# EAGLE schematic esp8266_ver3 (EAGLE 8.2.2)
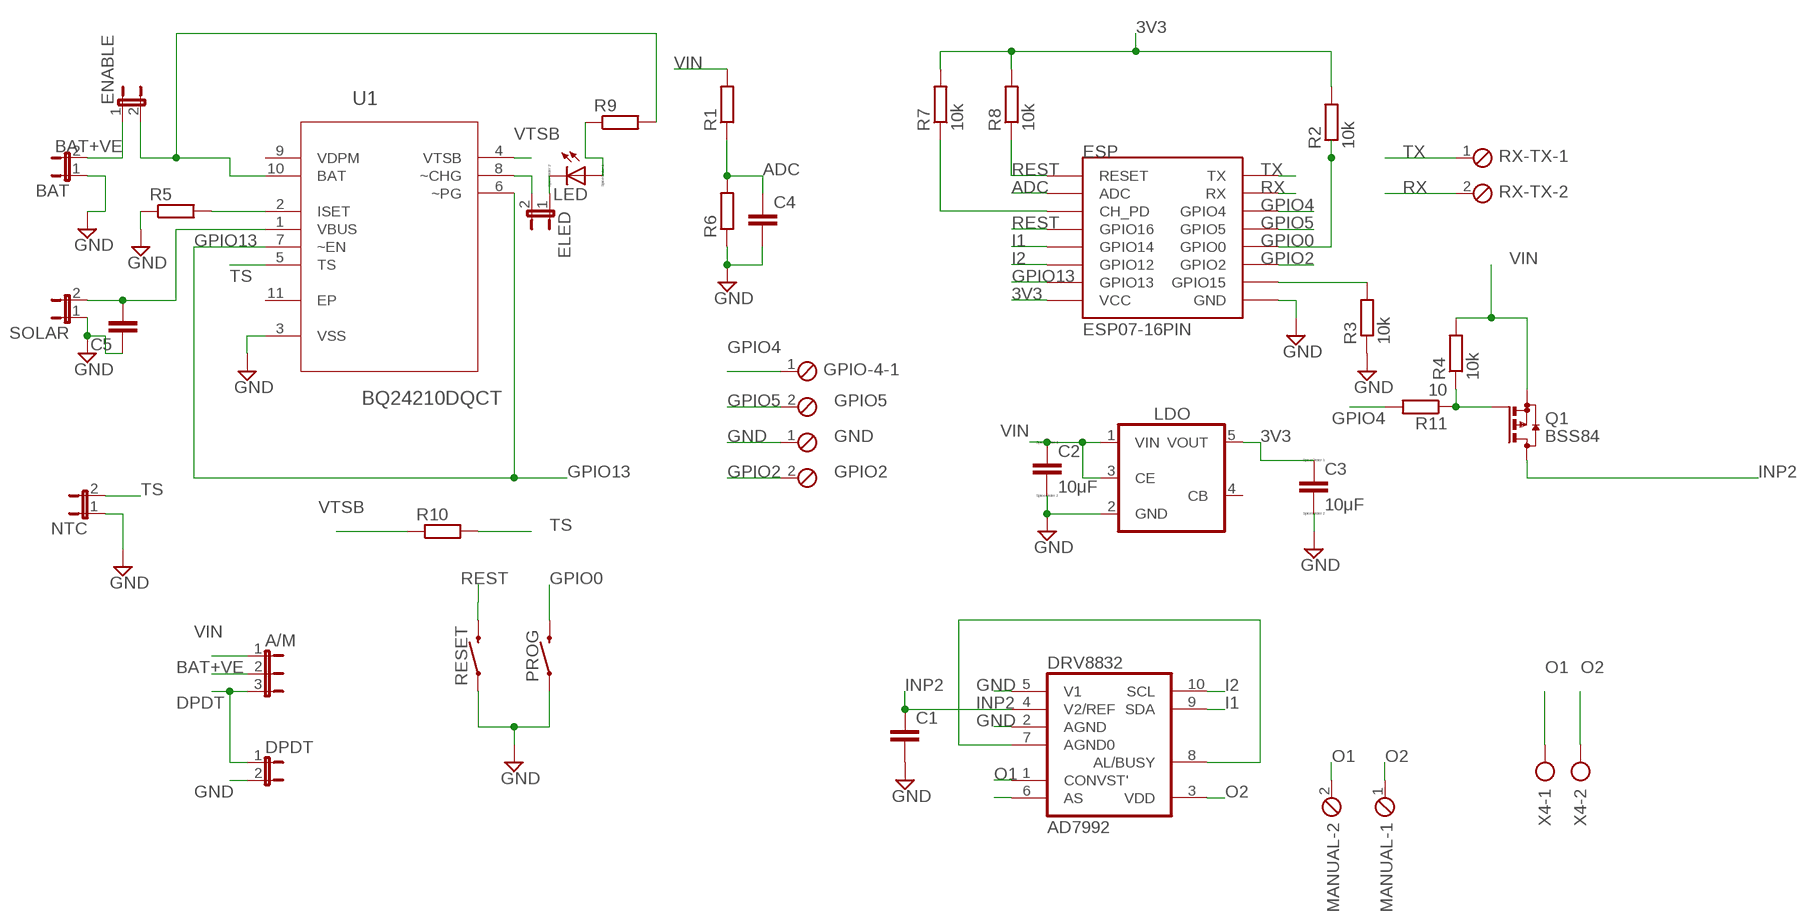
[diagram p0: schematic, sheet 1]

## Parts
A/M  JP2E  [JP2]
BAT  JP1E  [JP1]
C1  C-EUC0805K  [C0805K]
C2  10μF  CC1206  [C1206]
C3  10μF  CC1206  [C1206]
C4  C-EUC1206  [C1206]
C5  C-EUC1206  [C1206]
DPDT  JP1E  [JP1]
DRV8832  AD7992  [MSOP10]
ELED  JP1E  [JP1]
ENABLE  JP1E  [JP1]
ESP  ESP07-16PIN  [ESP07-16PIN]
GPIO-4  MPT2  [2POL254]
LDO  TS5205  [SOT25]
LED  LED_E  [LED_1206]
MANUAL  MPT2  [2POL254]
NTC  JP1E  [JP1]
PROG  MOMENTARY-SWITCH-SPST-SMD-5.2MM  [TACTILE_SWITCH_SMD_5.2MM]
Q1  BSS84  [SOT23]
R1  R-EU_R1206  [R1206]
R2  10k  R-EU_R1206  [R1206]
R3  10k  R-EU_R1206  [R1206]
R4  10k  R-EU_R1206  [R1206]
R5  R-EU_R1206  [R1206]
R6  R-EU_R1206  [R1206]
R7  10k  R-EU_R1206  [R1206]
R8  10k  R-EU_R1206  [R1206]
R9  R-EU_R1206  [R1206]
R10  R-EU_R1206  [R1206]
R11  10  R-EU_R1206  [R1206]
RESET  MOMENTARY-SWITCH-SPST-SMD-5.2MM  [TACTILE_SWITCH_SMD_5.2MM]
RX-TX  MPT2  [2POL254]
SOLAR  JP1E  [JP1]
U1  BQ24210DQCT  [SON50P200X300X80-11N]
X2  MPT2  [2POL254]
X4  AK300/2  [AK300/2]

## Nets
3V3: C3.1 ESP.VCC LDO.5(VOUT) R2.2 R7.2 R8.2
ADC: C4.1 ESP.ADC R1.1 R6.2
B: ENABLE.2 R9.2 U1.10(BAT)
BAT+VE: A/M.2 BAT.2 ENABLE.1
DPDT: A/M.3 DPDT.1
GND: BAT.1 C1.2 C2.2 C3.2 C4.2 C5.1 DPDT.2 DRV8832.2(AGND) DRV8832.5(V1) ESP.GND LDO.2(GND) NTC.1 PROG.1 R3.1 R5.1 R6.1 RESET.1 SOLAR.1 U1.3(VSS) X2.1
GPIO0: ESP.GPIO0 PROG.3 R2.1
GPIO2: ESP.GPIO2 X2.2
GPIO4: ESP.GPIO4 GPIO-4.1 R11.2
GPIO5: ESP.GPIO5 GPIO-4.2
GPIO13: ESP.GPIO13 U1.6(~PG) U1.7(~EN)
I1: DRV8832.9(SDA) ESP.GPIO14
I2: DRV8832.10(SCL) ESP.GPIO12
INP2: C1.1 DRV8832.4(V2/REF) Q1.3(D)
N$3: DRV8832.7(AGND0) DRV8832.8(AL/BUSY)
N$7: R5.2 U1.2(ISET)
N$8: Q1.1(G) R4.1 R11.1
N$10: ELED.2 U1.8(~CHG)
N$11: C5.2 SOLAR.2 U1.1(VBUS)
N$12: DRV8832.6(AS)
N$13: LED.A R9.1
N$14: ELED.1 LED.C
N$32: ESP.CH_PD R7.1
N$44: ESP.GPIO15 R3.2
O1: DRV8832.1(CONVST') MANUAL.2 X4.1
O2: DRV8832.3(VDD) MANUAL.1 X4.2
REST: ESP.GPIO16 ESP.REST(RESET) R8.1 RESET.3
RX: ESP.RX RX-TX.2
TS: NTC.2 R10.2 U1.5(TS)
TX: ESP.TX RX-TX.1
VIN: A/M.1 C2.1 LDO.1(VIN) LDO.3(CE) Q1.2(S) R1.2 R4.2
VTSB: R10.1 U1.4(VTSB)
Unconnected: LDO.4(CB) U1.9(VDPM) U1.11(EP)

## Notes on the sheet
- GPIO5
- GND
- GPIO2

## Library data of the parts
A/M = jumper:JP2E: JUMPER
BAT DPDT ELED ENABLE NTC SOLAR = jumper:JP1E: JUMPER
C1 C4 C5 = rcl:C-EU: CAPACITOR, European symbol
C2 C3 = eagle-ltspice:C: CAPACITOR, European symbol; SPICEMODEL: NONE; SPICEPREFIX: C
DRV8832 = analog_devices_gaui:AD7992: 16-Bit DAC with Serial Data Interface
ESP = esp8266modules:ESP07-16PIN
GPIO-4 MANUAL RX-TX X2 = con-phoenix-254:MPT2: PHOENIX CONNECTOR; OC_FARNELL: unknown; OC_NEWARK: unknown
LDO = v-reg:TS5205: 150mA Low Noise LDO Voltage Regulator with Enable TSC [Taiwan Semiconductor Company, Ltd] Source: http://www.taiwansemi.com .. 5205_0409c.pdf
LED = eagle-ltspice:LED_E: LED Source: http://www.osram.convergy.de Source: www.luxeon.com Source: www.kingbright.com; SPICEMODEL: NONE; SPICEPREFIX: D; SPICETYPE: diode
PROG RESET = SparkFun-Switches:MOMENTARY-SWITCH-SPST: Momentary Switch (Pushbutton) - SPST Normally-open (NO) SPST momentary switches (buttons, pushbuttons). Variants PTH-12MM - 12mm square, through-hole Momentary Pushbutton Switch - 12mm Square <https://www.sparkfun.com/products/9190> (COM-09190) PTH-6.0MM, PTH-6.0MM-KIT - 6.0mm square, through-hole Mini Pushbutton Switch <https://www.sparkfun.com/products/97> (COM-00097) KIT package intended for soldering kit's - only one side of pads' copper is exposed. PTH-RIGHT-ANGLE-KIT - Right-angle, through-hole Right Angle Tactile Button <https://www.sparkfun.com/products/10791> - Used on SparkFun BigTime Watch Kit <https://www.sparkfun.com/products/11734> SMD-12MM - 12mm square, surface-mount Tactile Button - SMD (12mm) <https://www.sparkfun.com/products/12993> (COM-12993) Used on SparkFun PicoBoard <https://www.sparkfun.com/products/11888> SMD-4.5MM - 4.5mm Square Trackball Switch Used on SparkFun Blackberry Trackballer Breakout <https://www.sparkfun.com/products/13169> SMD-4.6MMX2.8MM - 4.60mm x 2.80mm, surface mount Used on SparkFun SAMD21 Mini Breakout <https://www.sparkfun.com/products/13664> SMD-5.2MM, SMD-5.2-REDUNDANT - 5.2mm square, surface-mount Mini Pushbutton Switch - SMD <https://www.sparkfun.com/products/8720> (COM-08720) Used on Arduino Pro Mini <https://www.sparkfun.com/products/11114> REDUNDANT package connects both switch circuits together SMD-6.0X3.5MM - 6.0 x 3.5mm, surface mount Momentary Reset Switch SMD <https://www.sparkfun.com/products/8229> (COM-08229) SMD-6.2MM-TALL - 6.2mm square, surface mount Tactile Button - SMD (6mm) <https://www.sparkfun.com/products/12992> Used on SparkFun Digital Sandbox <https://www.sparkfun.com/products/12651> SMD-RIGHT-ANGLE - Right-angle, surface mount Used on SparkFun Block for Intel® Edison - Arduino <https://www.sparkfun.com/products/13036>; PROD_ID: SWCH-08247; SF_SKU: COM-08720
Q1 = transistor-small-signal:BSS84: P-CHANNEL MOS FET
R1 R4-R6 R9-R11 = resistor:R-EU_: RESISTOR, European symbol
R2 R3 R7 R8 = rcl:R-EU_: RESISTOR, European symbol
U1 = Texas Instruments_By_element14_Batch_1:BQ24210DQCT: Single Cell Li-Ion Battery Solar Charger; MPN: BQ24210DQCT; OC_FARNELL: 1903633; OC_NEWARK: 56T0491; PACKAGE: SON-10; SUPPLIER: TEXAS INSTRUMENTS
X4 = con-ptr500:AK300/2: CONNECTOR; OC_FARNELL: unknown; OC_NEWARK: unknown

## Net classes
0 default: width 0.508 mm